# Altium schematic sheet schematic_christmas_tree.SchDoc: Christmas Tree
size A4; CompanyName: AGH; Engineer: Krzysztof Sikora; Organization: KNE; Revision: 1; SheetNumber: 1; SheetTotal: 1
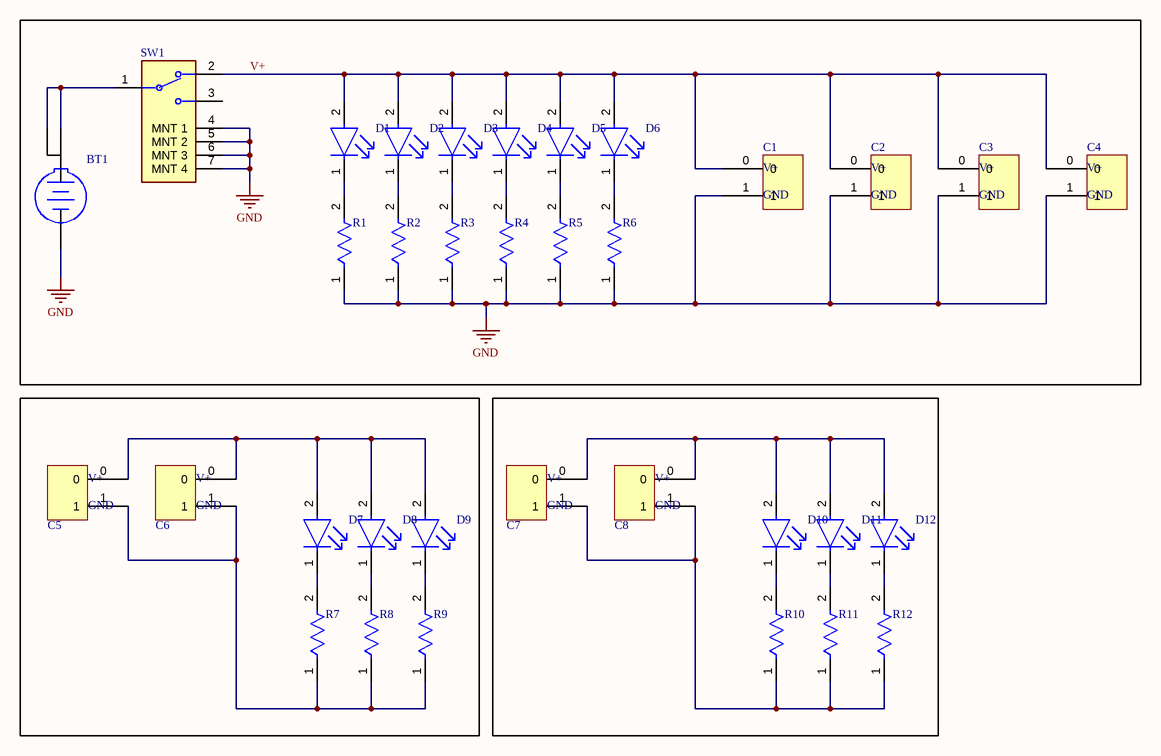
[diagram p0: schematic_christmas_tree.SchDoc]

## Parts
BT1  3001  [KSTN-3001_V]  (value not drawn)
C1  conn_pcb  [pcb_connector]  (value not drawn)
C2  conn_pcb  [pcb_connector]  (value not drawn)
C3  conn_pcb  [pcb_connector]  (value not drawn)
C4  conn_pcb  [pcb_connector]  (value not drawn)
C5  conn_pcb  [pcb_connector]  (value not drawn)
C6  conn_pcb  [pcb_connector]  (value not drawn)
C7  conn_pcb  [pcb_connector]  (value not drawn)
C8  conn_pcb  [pcb_connector]  (value not drawn)
D1  APHCM2012SYCK-F01  [FP-APHCM2012SYCK-F01-MFG]  (value not drawn)
D2  APHCM2012SYCK-F01  [FP-APHCM2012SYCK-F01-MFG]  (value not drawn)
D3  APHCM2012SYCK-F01  [FP-APHCM2012SYCK-F01-MFG]  (value not drawn)
D4  APHCM2012SYCK-F01  [FP-APHCM2012SYCK-F01-MFG]  (value not drawn)
D5  APHCM2012SYCK-F01  [FP-APHCM2012SYCK-F01-MFG]  (value not drawn)
D6  APHCM2012SYCK-F01  [FP-APHCM2012SYCK-F01-MFG]  (value not drawn)
D7  APHCM2012SYCK-F01  [FP-APHCM2012SYCK-F01-MFG]  (value not drawn)
D8  APHCM2012SYCK-F01  [FP-APHCM2012SYCK-F01-MFG]  (value not drawn)
D9  APHCM2012SYCK-F01  [FP-APHCM2012SYCK-F01-MFG]  (value not drawn)
D10  APHCM2012SYCK-F01  [FP-APHCM2012SYCK-F01-MFG]  (value not drawn)
D11  APHCM2012SYCK-F01  [FP-APHCM2012SYCK-F01-MFG]  (value not drawn)
D12  APHCM2012SYCK-F01  [FP-APHCM2012SYCK-F01-MFG]  (value not drawn)
R1  CRCW0603100RJNEA  [FP-CRCW0603-e3-IPC_B]  (value not drawn)
R2  CRCW0603100RJNEA  [FP-CRCW0603-e3-IPC_B]  (value not drawn)
R3  CRCW0603100RJNEA  [FP-CRCW0603-e3-IPC_B]  (value not drawn)
R4  CRCW0603100RJNEA  [FP-CRCW0603-e3-IPC_B]  (value not drawn)
R5  CRCW0603100RJNEA  [FP-CRCW0603-e3-IPC_B]  (value not drawn)
R6  CRCW0603100RJNEA  [FP-CRCW0603-e3-IPC_B]  (value not drawn)
R7  CRCW0603100RJNEA  [FP-CRCW0603-e3-IPC_B]  (value not drawn)
R8  CRCW0603100RJNEA  [FP-CRCW0603-e3-IPC_B]  (value not drawn)
R9  CRCW0603100RJNEA  [FP-CRCW0603-e3-IPC_B]  (value not drawn)
R10  CRCW0603100RJNEA  [FP-CRCW0603-e3-IPC_B]  (value not drawn)
R11  CRCW0603100RJNEA  [FP-CRCW0603-e3-IPC_B]  (value not drawn)
R12  CRCW0603100RJNEA  [FP-CRCW0603-e3-IPC_B]  (value not drawn)
SW1  PCM12SMTR  [FP-PCM12SMTR-MFG]  (value not drawn)

## Nets
GND: BT1.3(-) C1.1 C2.1 C3.1 C4.1 R1.1 R2.1 R3.1 R4.1 R5.1 R6.1 SW1.4(MNT_1) SW1.5(MNT_2) SW1.6(MNT_3) SW1.7(MNT_4)
V+: C1.0 C2.0 C3.0 C4.0 D1.2(A) D2.2(A) D3.2(A) D4.2(A) D5.2(A) D6.2(A) SW1.2
NetBT1_1: BT1.1(+) BT1.2(+) SW1.1
NetC5_0: C5.0 C6.0 D7.2(A) D8.2(A) D9.2(A)
NetC5_1: C5.1 C6.1 R7.1 R8.1 R9.1
NetC7_0: C7.0 C8.0 D10.2(A) D11.2(A) D12.2(A)
NetC7_1: C7.1 C8.1 R10.1 R11.1 R12.1
NetD1_1: D1.1(C) R1.2
NetD2_1: D2.1(C) R2.2
NetD3_1: D3.1(C) R3.2
NetD4_1: D4.1(C) R4.2
NetD5_1: D5.1(C) R5.2
NetD6_1: D6.1(C) R6.2
NetD7_1: D7.1(C) R7.2
NetD8_1: D8.1(C) R8.2
NetD9_1: D9.1(C) R9.2
NetD10_1: D10.1(C) R10.2
NetD11_1: D11.1(C) R11.2
NetD12_1: D12.1(C) R12.2

Not connected (* = marked no-connect by the designer): SW1 3

## Notes on the sheet
- (in symbol conn_pcb) V+; GND

## Library data of the parts
BT1 = CMP-2000-05463-1: Holder Battery Coin, 12 mm, 2-Pin THD, RoHS; Manufacturer: Keystone; Package Reference: 3001; Package Description: 2-Pin Through Hole Device, Body 13.21 x 12.07 mm; Datasheet Version: Rev. H, 09/2006; Datasheet URL: https://datasheet.ciiva.com/3/3001-3954.pdf; Mounting Technology: ThroughHole; Manufacturer URL: http://www.keyelco.com/
D1-D12 = CMP-44529-000064-1: LED YELLOW CLEAR CHIP SMD; Number of LEDs: 1; Luminous Intensity: 150mcd; Dominant Wavelength: 590nm; Test Current: 20mA; Illumination Color: Green; Forward Voltage: 2V; Viewing Angle: 110°; Number of Pins: 2; Packaging: Tape and Reel; Width: 1.25mm; Height: 0.4mm; Lens Color: Clear; RoHS Compliant: Yes; Lead Free: Lead Free; Min Operating Temperature: -40°C; Case Code (Imperial): 0805; Case/Package: 0805; Series: APHCM; Wavelength: 590nm; Max Operating Temperature: 85°C; Length: 2mm; Color: Yellow; Package Quantity: 2000; Mount: Surface Mount; Lens Style: Clear; Forward Current: 20mA; Case Code (Metric): 2012
R1-R12 = CMP-2000-03827-2: RES Thick Film, 100Ω, 5%, 0.1W, 200ppm/°C, 0603; Power Rating: 100mW; Voltage Rating: 75V; Resistance: 100R; Weight: 7.1E-05oz; Max Operating Temperature: 155°C; Military Standard: Not; Case Code (Imperial): 0603; Case/Package: 0603; Packaging: Tape and Reel; Number of Terminations: 2; Package Quantity: 1; Radiation Hardening: No; Termination: SMD/SMT; Case Code (Metric): 1608; Min Operating Temperature: -55°C; Height: 0.02inch; Length: 1.55mm; Tolerance: 5%; Width: 0.85mm; Contact Plating: Tin; Max Power Dissipation: 100mW; Features: Automotive AEC-Q200; Composition: Thick Film; Temperature Coefficient: 200ppm/°C; Depth: 0.85mm
SW1 = CMP-2000-06884-2: SWITCH SLIDE SPDT 300MA 6V; Actuator Material: Nylon; Switch Function: On-On; Insulation Resistance: 100mR; Actuator Type: Standard; Mechanical Life: 10000Cycles; Actuator Length: 1.5mm; Contact Resistance: 70mR; Min Operating Temperature: -20°C; Max Current Rating: 300mA; Max Voltage Rating (DC): 6V; Package Quantity: 1; Mount: Surface Mount; Packaging: Tape and Reel; Contact Plating: Silver; Depth: 5mm; REACH SVHC: No SVHC; Voltage Rating (DC): 6V; Voltage Rating (AC): 6V; Max Operating Temperature: 85°C; Length: 7.7mm; Termination: Gull Wing; Current Rating: 300mA; Contact Current Rating: 300mA; Orientation: Right Angle; Width: 6.7mm; Switch Travel: 1.5mm; Lead Free: Lead Free; Contact Material: Copper Alloy; Throw Configuration: SPDT